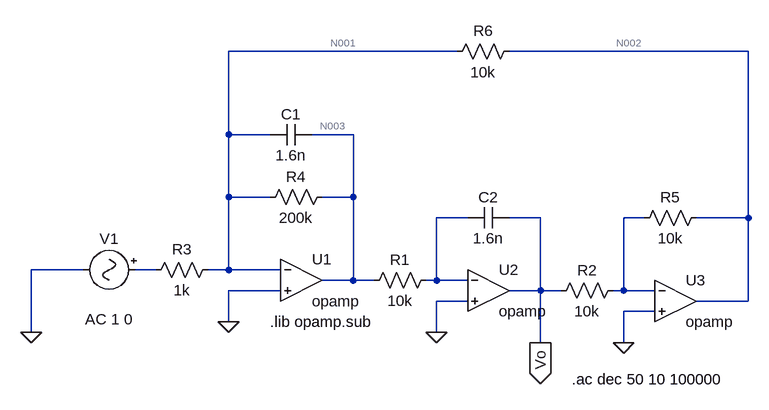
[diagram p0: schematic BookP1.asc]
BookP1.asc, the LTspice schematic file:
Version 4.1
SHEET 1 880 680
WIRE 304 -176 -48 -176
WIRE 752 -176 384 -176
WIRE -48 -48 -48 -176
WIRE 16 -48 -48 -48
WIRE 144 -48 80 -48
WIRE -48 48 -48 -48
WIRE 16 48 -48 48
WIRE 144 48 144 -48
WIRE 144 48 96 48
WIRE 320 80 272 80
WIRE 432 80 384 80
WIRE 592 80 560 80
WIRE 752 80 752 -176
WIRE 752 80 672 80
WIRE -272 160 -352 160
WIRE -160 160 -192 160
WIRE -48 160 -48 48
WIRE -48 160 -80 160
WIRE 32 160 -48 160
WIRE 144 176 144 48
WIRE 144 176 96 176
WIRE 176 176 144 176
WIRE 272 176 272 80
WIRE 272 176 256 176
WIRE 320 176 272 176
WIRE 32 192 -48 192
WIRE 432 192 432 80
WIRE 432 192 384 192
WIRE 464 192 432 192
WIRE 560 192 560 80
WIRE 560 192 544 192
WIRE 608 192 560 192
WIRE 320 208 272 208
WIRE 752 208 752 80
WIRE 752 208 672 208
WIRE 608 224 560 224
WIRE -48 240 -48 192
WIRE -352 256 -352 160
WIRE 272 256 272 208
WIRE 432 272 432 192
WIRE 560 272 560 224
FLAG -352 256 0
FLAG 432 272 Vo
IOPIN 432 272 Out
FLAG -48 240 0
FLAG 272 256 0
FLAG 560 272 0
SYMBOL res 272 160 R90
WINDOW 0 0 56 VBottom 2
WINDOW 3 32 56 VTop 2
SYMATTR InstName R1
SYMATTR Value 10k
SYMBOL res 560 176 R90
WINDOW 0 0 56 VBottom 2
WINDOW 3 32 56 VTop 2
SYMATTR InstName R2
SYMATTR Value 10k
SYMBOL res -64 144 R90
WINDOW 0 0 56 VBottom 2
WINDOW 3 32 56 VTop 2
SYMATTR InstName R3
SYMATTR Value 1k
SYMBOL res 112 32 R90
WINDOW 0 0 56 VBottom 2
WINDOW 3 32 56 VTop 2
SYMATTR InstName R4
SYMATTR Value 200k
SYMBOL cap 80 -64 R90
WINDOW 0 0 32 VBottom 2
WINDOW 3 32 32 VTop 2
SYMATTR InstName C1
SYMATTR Value 1.6n
SYMBOL cap 384 64 R90
WINDOW 0 0 32 VBottom 2
WINDOW 3 32 32 VTop 2
SYMATTR InstName C2
SYMATTR Value 1.6n
SYMBOL res 688 64 R90
WINDOW 0 0 56 VBottom 2
WINDOW 3 32 56 VTop 2
SYMATTR InstName R5
SYMATTR Value 10k
SYMBOL res 400 -192 R90
WINDOW 0 0 56 VBottom 2
WINDOW 3 32 56 VTop 2
SYMATTR InstName R6
SYMATTR Value 10k
SYMBOL Misc\\signal -176 160 R90
WINDOW 0 -32 56 VBottom 2
WINDOW 3 32 56 VTop 2
WINDOW 123 60 56 VTop 2
WINDOW 39 0 0 Left 0
SYMATTR InstName V1
SYMATTR Value ""
SYMATTR Value2 AC 1 0
SYMBOL OpAmps\\opamp 64 112 R0
SYMATTR InstName U1
SYMBOL OpAmps\\opamp 352 128 R0
SYMATTR InstName U2
SYMBOL OpAmps\\opamp 640 144 R0
SYMATTR InstName U3
TEXT 480 328 Left 2 !.ac dec 50 10 100000
TEXT 16 240 Left 2 !.lib opamp.sub

The netlist it stands for:
* BookP1.asc
R1 N004 N003 10k
R2 N005 Vo 10k
R3 N001 N006 1k
R4 N003 N001 200k
C1 N003 N001 1.6n
C2 Vo N004 1.6n
R5 N002 N005 10k
R6 N002 N001 10k
V1 N006 0 AC 1 0
X§U1 N001 0 N003 opamp Aol=100K GBW=10Meg  ; pins invin noninvin out
X§U2 N004 0 Vo opamp Aol=100K GBW=10Meg  ; pins invin noninvin out
X§U3 N005 0 N002 opamp Aol=100K GBW=10Meg  ; pins invin noninvin out
.ac dec 50 10 100000
.lib opamp.sub
.backanno
.end

* Results of the author's LTspice run, read from the files saved beside the schematic
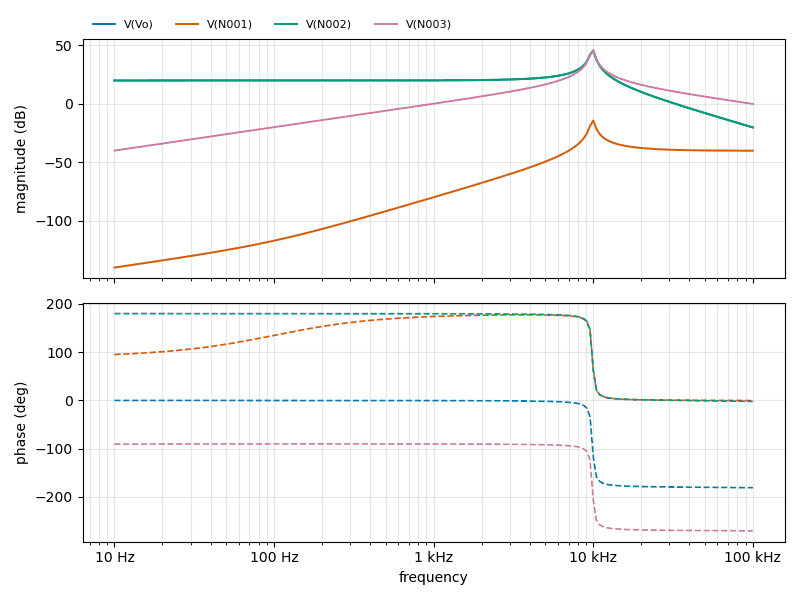
[diagram p1: AC Analysis of BookP1.asc, plotted from the saved traces]
* AC Analysis, 1 run:
*   V(Vo): 20.00 dB at 10 Hz, -20.11 dB at 100 kHz, peak 45.72 dB at 10 kHz, 3 dB below the peak at 9.646 kHz and 10.17 kHz
*   V(N001): -139.90 dB at 10 Hz, -40.06 dB at 100 kHz, peak -14.22 dB at 10 kHz, 3 dB below the peak at 9.706 kHz and 10.19 kHz
*   V(N002): 20.00 dB at 10 Hz, -20.11 dB at 100 kHz, peak 45.72 dB at 10 kHz, 3 dB below the peak at 9.646 kHz and 10.17 kHz
*   V(N003): -39.94 dB at 10 Hz, -0.06 dB at 100 kHz, peak 45.78 dB at 10 kHz, 3 dB below the peak at 9.679 kHz and 10.18 kHz